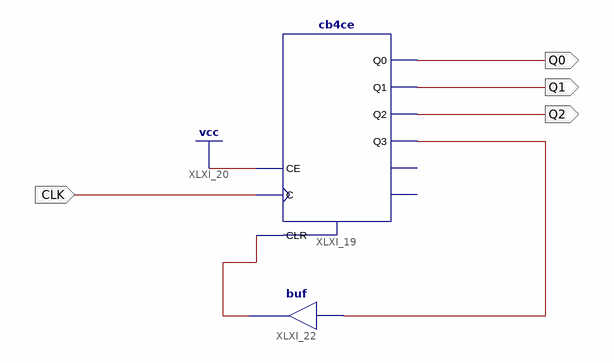
[diagram p0: schematic sheet 1]
// Xilinx ISE schematic counter0_7.sch (spartan6) as structural Verilog: 2 symbols, 4 ports
module counter0_7 (
  input  CLK,
  output Q0,
  output Q1,
  output Q2
);

  wire XLXN_47, XLXN_50;

  cb4ce XLXI_19 (.C(CLK), .CE(1'b1), .CLR(XLXN_50), .Q0(Q0), .Q1(Q1), .Q2(Q2), .Q3(XLXN_47));  // open: CEO, TC
  buf XLXI_22 (XLXN_50, XLXN_47);
endmodule
